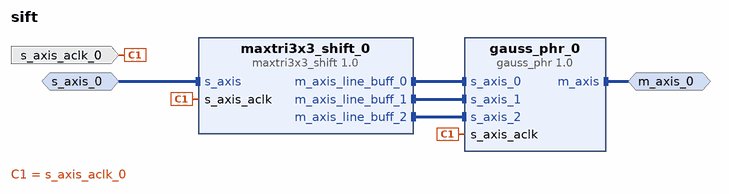
[diagram p0: block diagram of the top level]
# Vivado block design sift, xc7z020clg400-1, Vivado 2018.1
create_bd_design sift

create_bd_intf_port -mode Slave -vlnv xilinx.com:interface:axis_rtl:1.0 s_axis_0
set_property -dict [list \
  CONFIG.TDATA_NUM_BYTES 1 \
  CONFIG.TDEST_WIDTH 0 \
  CONFIG.TID_WIDTH 0 \
  CONFIG.TUSER_WIDTH 1 \
  CONFIG.HAS_TREADY 1 \
  CONFIG.HAS_TSTRB 0 \
  CONFIG.HAS_TKEEP 0 \
  CONFIG.HAS_TLAST 1 \
  CONFIG.LAYERED_METADATA undef \
] [get_bd_intf_ports s_axis_0]
create_bd_intf_port -mode Master -vlnv xilinx.com:interface:axis_rtl:1.0 m_axis_0
create_bd_port -dir I -type clk s_axis_aclk_0

create_bd_cell -type ip -vlnv xilinx.com:user:gauss_phr:1.0 gauss_phr_0
create_bd_cell -type ip -vlnv xilinx.com:user:maxtri3x3_shift:1.0 maxtri3x3_shift_0

# ---- connections ----

connect_bd_intf_net [get_bd_intf_pins gauss_phr_0/s_axis_0] [get_bd_intf_pins maxtri3x3_shift_0/m_axis_line_buff_0]
connect_bd_intf_net [get_bd_intf_pins maxtri3x3_shift_0/m_axis_line_buff_1] [get_bd_intf_pins gauss_phr_0/s_axis_1]
connect_bd_intf_net [get_bd_intf_pins maxtri3x3_shift_0/m_axis_line_buff_2] [get_bd_intf_pins gauss_phr_0/s_axis_2]
connect_bd_intf_net -intf_net s_axis_0_1 [get_bd_intf_ports s_axis_0] [get_bd_intf_pins maxtri3x3_shift_0/s_axis]
connect_bd_intf_net [get_bd_intf_ports m_axis_0] [get_bd_intf_pins gauss_phr_0/m_axis]
connect_bd_net -net s_axis_aclk_0_1 [get_bd_ports s_axis_aclk_0] [get_bd_pins gauss_phr_0/s_axis_aclk] [get_bd_pins maxtri3x3_shift_0/s_axis_aclk]

validate_bd_design
save_bd_design
